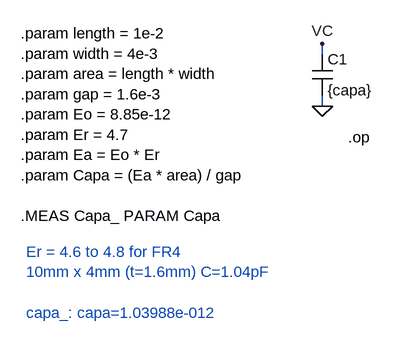
[diagram p0: schematic Fig_4-52_CAPA-MEAS.asc]
Fig_4-52_CAPA-MEAS.asc, the LTspice schematic file:
Version 4
SHEET 1 880 680
WIRE 512 112 512 96
WIRE 512 192 512 176
FLAG 512 192 0
FLAG 512 96 VC
SYMBOL cap 496 112 R0
SYMATTR InstName C1
SYMATTR Value {capa}
TEXT 48 80 Left 2 !.param length = 1e-2\n.param width = 4e-3\n.param area = length * width\n.param gap = 1.6e-3\n.param Eo = 8.85e-12\n.param Er = 4.7\n.param Ea = Eo * Er\n.param Capa = (Ea * area) / gap\n \n.MEAS Capa_ PARAM Capa
TEXT 552 240 Left 2 !.op
TEXT 56 416 Left 2 ;Er = 4.6 to 4.8 for FR4\n10mm x 4mm (t=1.6mm) C=1.04pF\n \ncapa_: capa=1.03988e-012

The netlist it stands for:
* Fig_4-52_CAPA-MEAS.asc
C1 VC 0 {capa}
.param length = 1e-2
.param width = 4e-3
.param area = length * width
.param gap = 1.6e-3
.param Eo = 8.85e-12
.param Er = 4.7
.param Ea = Eo * Er
.param Capa = (Ea * area) / gap
.MEAS Capa_ PARAM Capa
.op
* Er = 4.6 to 4.8 for FR4
* 10mm x 4mm (t=1.6mm) C=1.04pF
* capa_: capa=1.03988e-012
.backanno
.end